# Altium schematic sheet Sheet3.SchDoc
size A4
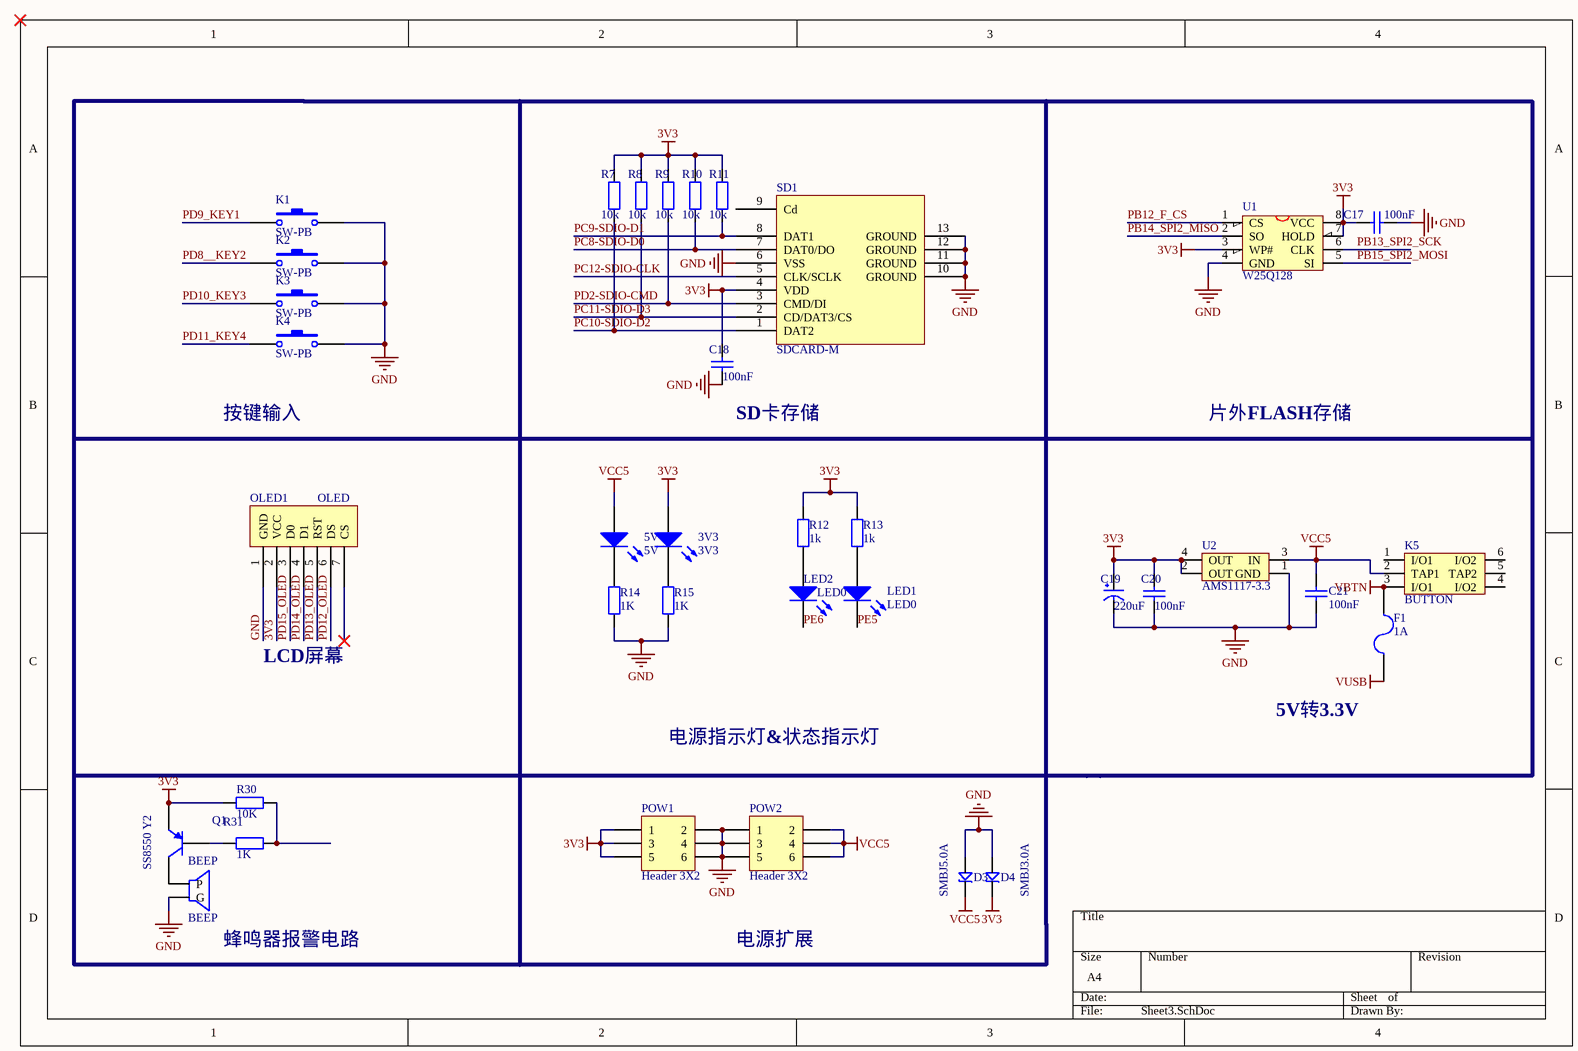
[diagram p0: Sheet3.SchDoc]

## Parts
3V3  3V3  [LED_0805]
5V  5V  [LED_0805]
BEEP  BEEP  [BUZZER]
C17  100nF  [LC-0603_C]
C18  100nF  [LC-0603_C]
C19  220uF  [CAP_10*10]
C20  100nF  [LC-0603_C]
C21  100nF  [LC-0603_C]
D3  SMBJ5.0A  [D1812]
D4  SMBJ3.0A  [D1812]
F1  value 1A  [LC-1206_R]  (hidden comment: Fuse)
K1  SW-PB  [SW-SMD1]
K2  SW-PB  [SW-SMD1]
K3  SW-PB  [SW-SMD1]
K4  SW-PB  [SW-SMD1]
K5  BUTTON  [DPDT]
LED1  LED0  [LED_0805]
LED2  LED0  [LED_0805]
OLED1  OLED  [OLED_096]
POW1  Header 3X2  [HDR2X3]
POW2  Header 3X2  [HDR2X3]
Q1  SS8550 Y2  [LC-SOT-23(SOT-23-3)]
R7  10k  [LC-0603_R]
R8  10k  [LC-0603_R]
R9  10k  [LC-0603_R]
R10  10k  [LC-0603_R]
R11  10k  [LC-0603_R]
R12  1k  [LC-0603_R]
R13  1k  [LC-0603_R]
R14  1K  [LC-0603_R]
R15  1K  [LC-0603_R]
R30  10K  [LC-0603_R]
R31  1K  [LC-0603_R]
SD1  SDCARD-M  [TF_CARD]
U1  W25Q128  [SOIC-8]
U2  AMS1117-3.3  [SOT-233]

## Nets
3V3: 3V3.1(A) C17.2 C18.2 C19.1(VCC) C20.2 D4.2 OLED1.2(VCC) POW1.1 POW1.3 POW1.5 Q1.2(E) R7.1 R8.1 R9.1 R10.1 R11.1 R12.1 R13.1 R30.2 SD1.4(VDD) U1.3(WP#) U1.7(HOLD) U1.8(VCC) U2.2(OUT) U2.4(OUT)
GND: BEEP.2(G) C17.1 C18.1 C19.2(GND) C20.1 C21.1 D3.1 D4.1 K1.2 K2.2 K3.2 K4.2 OLED1.1(GND) POW1.2 POW1.4 POW1.6 POW2.1 POW2.3 POW2.5 R14.1 R15.1 SD1.6(VSS) SD1.10(GROUND) SD1.11(GROUND) SD1.12(GROUND) SD1.13(GROUND) U1.4(GND) U2.1(GND)
VBTN: F1.2 K5.3(I/O1)
VCC5: 5V.1(A) C21.2 D3.2 K5.2(TAP1) POW2.2 POW2.4 POW2.6 U2.3(IN)
VUSB: F1.1
PB12_F_CS: U1.1(CS)
PB13_SPI2_SCK: U1.6(CLK)
PB14_SPI2_MISO: U1.2(SO)
PB15_SPI2_MOSI: U1.5(SI)
PC8-SDIO-D0: R10.2 SD1.7(DAT0/DO)
PC9-SDIO-D1: R11.2 SD1.8(DAT1)
PC10-SDIO-D2: R7.2 SD1.1(DAT2)
PC11-SDIO-D3: R8.2 SD1.2(CD/DAT3/CS)
PC12-SDIO-CLK: SD1.5(CLK/SCLK)
PD2-SDIO-CMD: R9.2 SD1.3(CMD/DI)
PD8__KEY2: K2.1
PD9_KEY1: K1.1
PD10_KEY3: K3.1
PD11_KEY4: K4.1
PD12_OLED: OLED1.6(DS)
PD13_OLED: OLED1.5(RST)
PD14_OLED: OLED1.4(D1)
PD15_OLED: OLED1.3(D0)
PE5: LED1.2(K)
PE6: LED2.2(K)
Net3V3_2: 3V3.2(K) R15.2
Net5V_2: 5V.2(K) R14.2
NetBEEP_1: BEEP.1(P) Q1.3(C)
NetLED1_1: LED1.1(A) R13.2
NetLED2_1: LED2.1(A) R12.2
NetQ1_1: Q1.1(B) R31.2
NetR30_1: R30.1 R31.1

Not connected (* = marked no-connect by the designer): K5 1(I/O1) 4(I/O2) 5(TAP2) 6(I/O2); OLED1 7(CS)*; SD1 9(Cd)

## Notes on the sheet
- 按键输入
- (near C18) SD卡存储
- 片外FLASH存储
- LCD屏幕
- 5V转3.3V
- 电源指示灯&状态指示灯
- (near BEEP) 蜂鸣器报警电路
- 电源扩展

## Library data of the parts
3V3 5V LED1 LED2 = LED0: Typical INFRARED GaAs LED; Published: 8-Jun-2000; LatestRevisionDate: 08-Jul-2005; LatestRevisionNote: Mech Layer 1 removed.; PackageReference: LED-0; Publisher: Altium Limited
C17 C18 C20 C21 = Cap: 无极性电容; Published: 8-Jun-2000; LatestRevisionDate: 17-Jul-2002; LatestRevisionNote: Re-released for DXP Platform.; PackageReference: RAD-0.3; Publisher: Altium Limited
C19 = CAP
D3 D4 = SMBJ: TVS
F1 = Fuse 2: 保险丝; Published: 8-Jun-2000; LatestRevisionDate: 17-Jul-2002; LatestRevisionNote: Re-released for DXP Platform.; PackageReference: PIN-W2/E2.8; Publisher: Altium Limited
K1-K4 = SW-PB: Switch; Published: 24-Mar-1999; LatestRevisionDate: 17-Jul-2002; LatestRevisionNote: Re-released for DXP Platform.; PackageReference: SPST-2; Publisher: Altium Limited; PackageDescription: Switch; 2 Leads
OLED1 = OLED_SPI: OLED屏幕
POW1 POW2 = Header 3X2: Header, 3-Pin, Dual row; LatestRevisionDate: 17-Jul-2002; LatestRevisionNote: Re-released for DXP Platform.; Publisher: Altium Limited
Q1 = SOT-23 SS8550 Y2: 三极管; ComponentLink1Description: 供应商链接; ComponentLink1URL: http://www.szlcsc.com/product/details_9037.html; Package: SOT-23; Supplier: LC; SuppliersPartNumber: C8542
R7-R11 = Res1: 贴片电阻; Value: 1K; Published: 8-Jun-2000; LatestRevisionDate: 17-Jul-2002; LatestRevisionNote: Re-released for DXP Platform.; PackageReference: AXIAL-0.4; Publisher: Altium Limited
R12 R13 = Res1: 贴片电阻; Published: 8-Jun-2000; LatestRevisionDate: 17-Jul-2002; LatestRevisionNote: Re-released for DXP Platform.; PackageReference: AXIAL-0.4; Publisher: Altium Limited; Value: 1K
R14 R15 R30 R31 = 0603 1.1KΩ (1101) 1%: 贴片电阻; ComponentLink1Description: 供应商链接; ComponentLink1URL: http://www.szlcsc.com/product/details_23491.html; Package: 0603; Supplier: LC; SuppliersPartNumber: C22764
SD1 = SDCARD-M: TF卡槽
U1 = W25X16: W25X16;SST25VF016;MX25L1605
U2 = AMS1117